# EAGLE design audio_spectrum (EAGLE 6.6.0)
AUTHOR: Joshua Adkins; REV: B; TITLE: AUDIO SPECTRUM MODULE

## Sheet 1 of 2
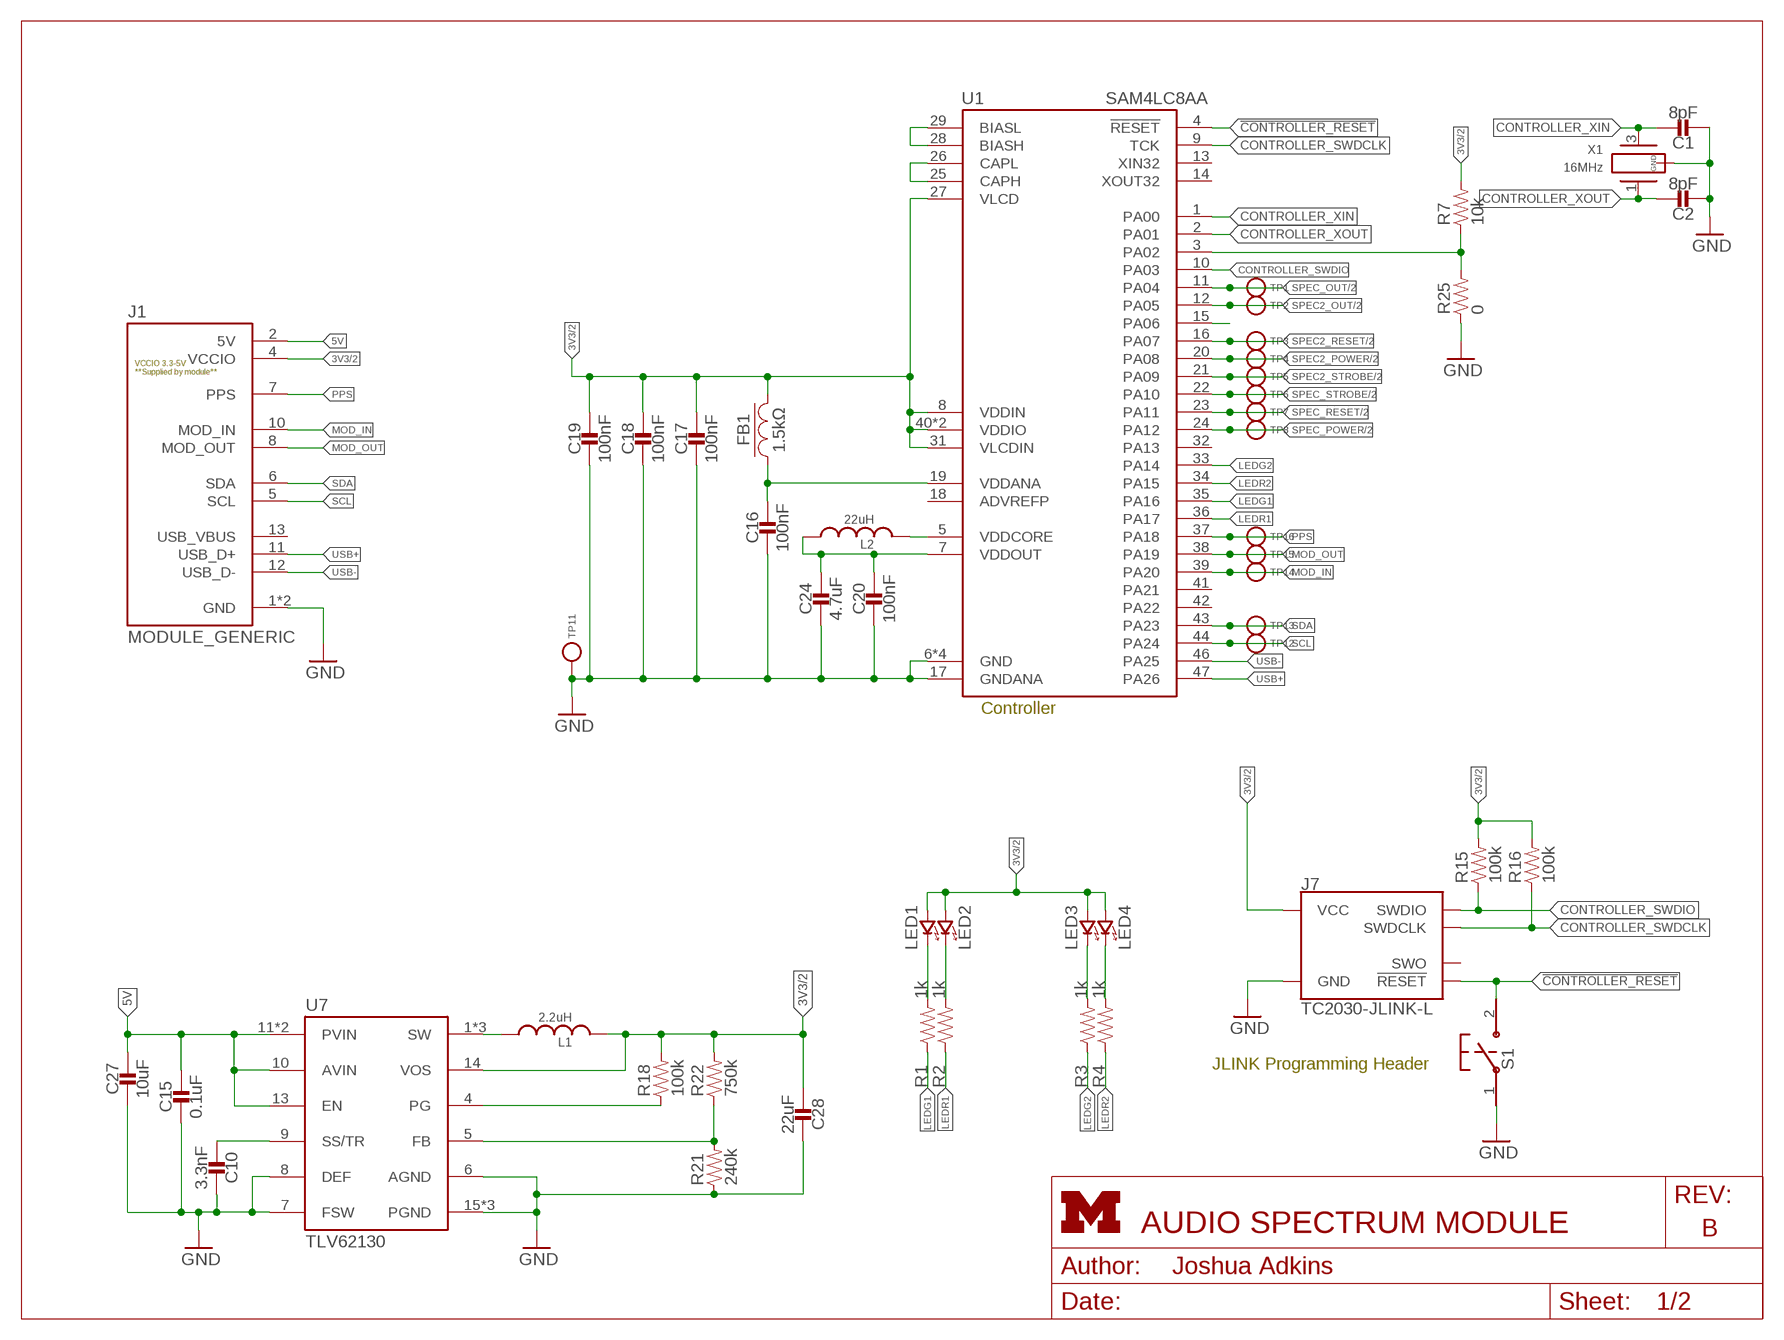
[diagram p0: schematic, sheet 1]
FRAME1 (LETTER_L_UMICH): HEIGHT: 8.5in; WIDTH: 11in

### Parts
C1  8pF  CAPACITOR0603_CAP  [0603_CAP]
C2  8pF  CAPACITOR0603_CAP  [0603_CAP]
C10  3.3nF  CAPACITOR0603_CAP  [0603_CAP]
C15  0.1uF  CAPACITOR0603_CAP  [0603_CAP]
C16  100nF  CAPACITOR0603_CAP  [0603_CAP]
C17  100nF  CAPACITOR0603_CAP  [0603_CAP]
C18  100nF  CAPACITOR0603_CAP  [0603_CAP]
C19  100nF  CAPACITOR0603_CAP  [0603_CAP]
C20  100nF  CAPACITOR0402_CAP  [0402_CAP]
C24  4.7uF  CAPACITOR0402_CAP  [0402_CAP]
C27  10uF  CAPACITOR0603_CAP  [0603_CAP]
C28  22uF  CAPACITOR0603_CAP  [0603_CAP]
FB1  1.5kΩ  FERRITE_BEAD0603  [0603_CAP]
J1  MODULE_GENERIC  [MODULE_GENERIC]
J7  TC2030-JLINK-L  [TC2030-IDC]
L1  2.2uH  INDUCTORIHL  [IHL-1212BZ-11]
L2  22uH  LHQ3NP  [1212]
LED1  LED0603  [LED-0603]
LED2  LED0603  [LED-0603]
LED3  LED0603  [LED-0603]
LED4  LED0603  [LED-0603]
R1  1k  RESISTOR0603_RES  [0603-RES]
R2  1k  RESISTOR0603_RES  [0603-RES]
R3  1k  RESISTOR0603_RES  [0603-RES]
R4  1k  RESISTOR0603_RES  [0603-RES]
R7  10k  RESISTOR0603_RES  [0603-RES]
R15  100k  RESISTOR0603_RES  [0603-RES]
R16  100k  RESISTOR0603_RES  [0603-RES]
R18  100k  RESISTOR0603_RES  [0603-RES]
R21  240k  RESISTOR0603_RES  [0603-RES]
R22  750k  RESISTOR0603_RES  [0603-RES]
R25  0  RESISTOR0603_RES  [0603-RES]
S1  B3U-1000P  [B3U-1000P]
TP1  TEST_POINT_0.040IN  [TESTPOINT_0.040IN]
TP2  TEST_POINT_0.040IN  [TESTPOINT_0.040IN]
TP3  TEST_POINT_0.040IN  [TESTPOINT_0.040IN]
TP4  TEST_POINT_0.040IN  [TESTPOINT_0.040IN]
TP5  TEST_POINT_0.040IN  [TESTPOINT_0.040IN]
TP6  TEST_POINT_0.040IN  [TESTPOINT_0.040IN]
TP7  TEST_POINT_0.040IN  [TESTPOINT_0.040IN]
TP8  TEST_POINT_0.040IN  [TESTPOINT_0.040IN]
TP11  TEST_POINT_0.040IN  [TESTPOINT_0.040IN]
TP12  TEST_POINT_0.040IN  [TESTPOINT_0.040IN]
TP13  TEST_POINT_0.040IN  [TESTPOINT_0.040IN]
TP14  TEST_POINT_0.040IN  [TESTPOINT_0.040IN]
TP15  TEST_POINT_0.040IN  [TESTPOINT_0.040IN]
TP16  TEST_POINT_0.040IN  [TESTPOINT_0.040IN]
U1  SAM4LC8AA  [QFN-48-7MM]
U7  TLV62130  [TQFN-16/3MM]
X1  16MHz  FH1600015  [FHXXX]

### Nets
3V3: C17.1 C18.1 C19.1 C28.2 FB1.2 J1.4(VCCIO) J7.1(VCC) L1.P$2 LED1.A(ANODE) LED2.A(ANODE) LED3.A(ANODE) LED4.A(ANODE) R7.2 R15.2 R16.2 R18.2 R22.2 U1.8(VDDIN) U1.27(VLCD) U1.31(VLCDIN) U1.40(VDDIO) U1.45(VDDIO) U7.14(VOS) ; also sheet 2
3VSWOUT: L1.P$1 U7.1(SW) U7.2(SW) U7.3(SW)
5V: C15.1 C27.1 J1.2(5V) U7.10(AVIN) U7.11(PVIN) U7.12(PVIN) U7.13(EN)
!CONTROLLER_RESET: J7.3(!RESET) S1.2 U1.4(!RESET)
CONTROLLER_BUCK/LDO_N: R7.1 R25.2 U1.3(PA02)
CONTROLLER_SWDCLK: J7.4(SWDCLK) R16.1 U1.9(TCK)
CONTROLLER_SWDIO: J7.2(SWDIO) R15.1 U1.10(PA03)
CONTROLLER_XIN: C1.1 U1.1(PA00) X1.3
CONTROLLER_XOUT: C2.1 U1.2(PA01) X1.1
GND: C1.2 C2.2 C10.1 C15.2 C16.2 C17.2 C18.2 C19.2 C20.2 C24.2 C27.2 C28.1 J1.1(GND) J1.14(GND) J7.5(GND) R21.1 R25.1 S1.1 TP11.TESTPOINT U1.6(GND) U1.17(GNDANA) U1.30(GND) U1.48(GND) U1.THERMAL(GND) U7.6(AGND) U7.7(FSW) U7.8(DEF) U7.15(PGND) U7.16(PGND) U7.GND X1.2(GND) X1.4(GND) ; also sheet 2
LEDG1: R1.1 U1.35(PA16)
LEDG2: R3.1 U1.33(PA14)
LEDR1: R2.1 U1.36(PA17)
LEDR2: R4.1 U1.34(PA15)
MOD_IN: J1.10(MOD_IN) TP14.TESTPOINT U1.39(PA20)
MOD_OUT: J1.8(MOD_OUT) TP15.TESTPOINT U1.38(PA19)
N$21: LED1.C(CATHODE) R1.2
N$23: LED2.C(CATHODE) R2.2
N$25: LED4.C(CATHODE) R4.2
N$31: U1.15(PA06)
N$32: C16.1 FB1.1 U1.19(VDDANA)
N$33: LED3.C(CATHODE) R3.2
N$34: C10.2 U7.9(SS/TR)
N$36: R18.1 U7.4(PG)
N$37: R21.2 R22.1 U7.5(FB)
N$44: C20.1 C24.1 L2.P$1 U1.7(VDDOUT)
N$52: L2.P$2 U1.5(VDDCORE)
N$53: U1.28(BIASH) U1.29(BIASL)
N$54: U1.25(CAPH) U1.26(CAPL)
PPS: J1.7(PPS) TP16.TESTPOINT U1.37(PA18)
SCL: J1.5(SCL) TP12.TESTPOINT U1.44(PA24)
SDA: J1.6(SDA) TP13.TESTPOINT U1.43(PA23)
SPEC2_OUT: TP2.TESTPOINT U1.12(PA05) ; also sheet 2
SPEC2_POWER: TP4.TESTPOINT U1.20(PA08) ; also sheet 2
SPEC2_RESET: TP3.TESTPOINT U1.16(PA07) ; also sheet 2
SPEC2_STROBE: TP5.TESTPOINT U1.21(PA09) ; also sheet 2
SPEC_OUT: TP1.TESTPOINT U1.11(PA04) ; also sheet 2
SPEC_POWER: TP8.TESTPOINT U1.24(PA12) ; also sheet 2
SPEC_RESET: TP7.TESTPOINT U1.23(PA11) ; also sheet 2
SPEC_STROBE: TP6.TESTPOINT U1.22(PA10) ; also sheet 2
USB+: J1.11(USB_D+) U1.47(PA26)
USB-: J1.12(USB_D-) U1.46(PA25)
Unconnected: J1.13(USB_VBUS) J7.6(SWO) U1.13(XIN32) U1.14(XOUT32) U1.18(ADVREFP) U1.32(PA13) U1.41(PA21) U1.42(PA22)

### Notes on the sheet
- Controller
- JLINK Programming Header

## Sheet 2 of 2
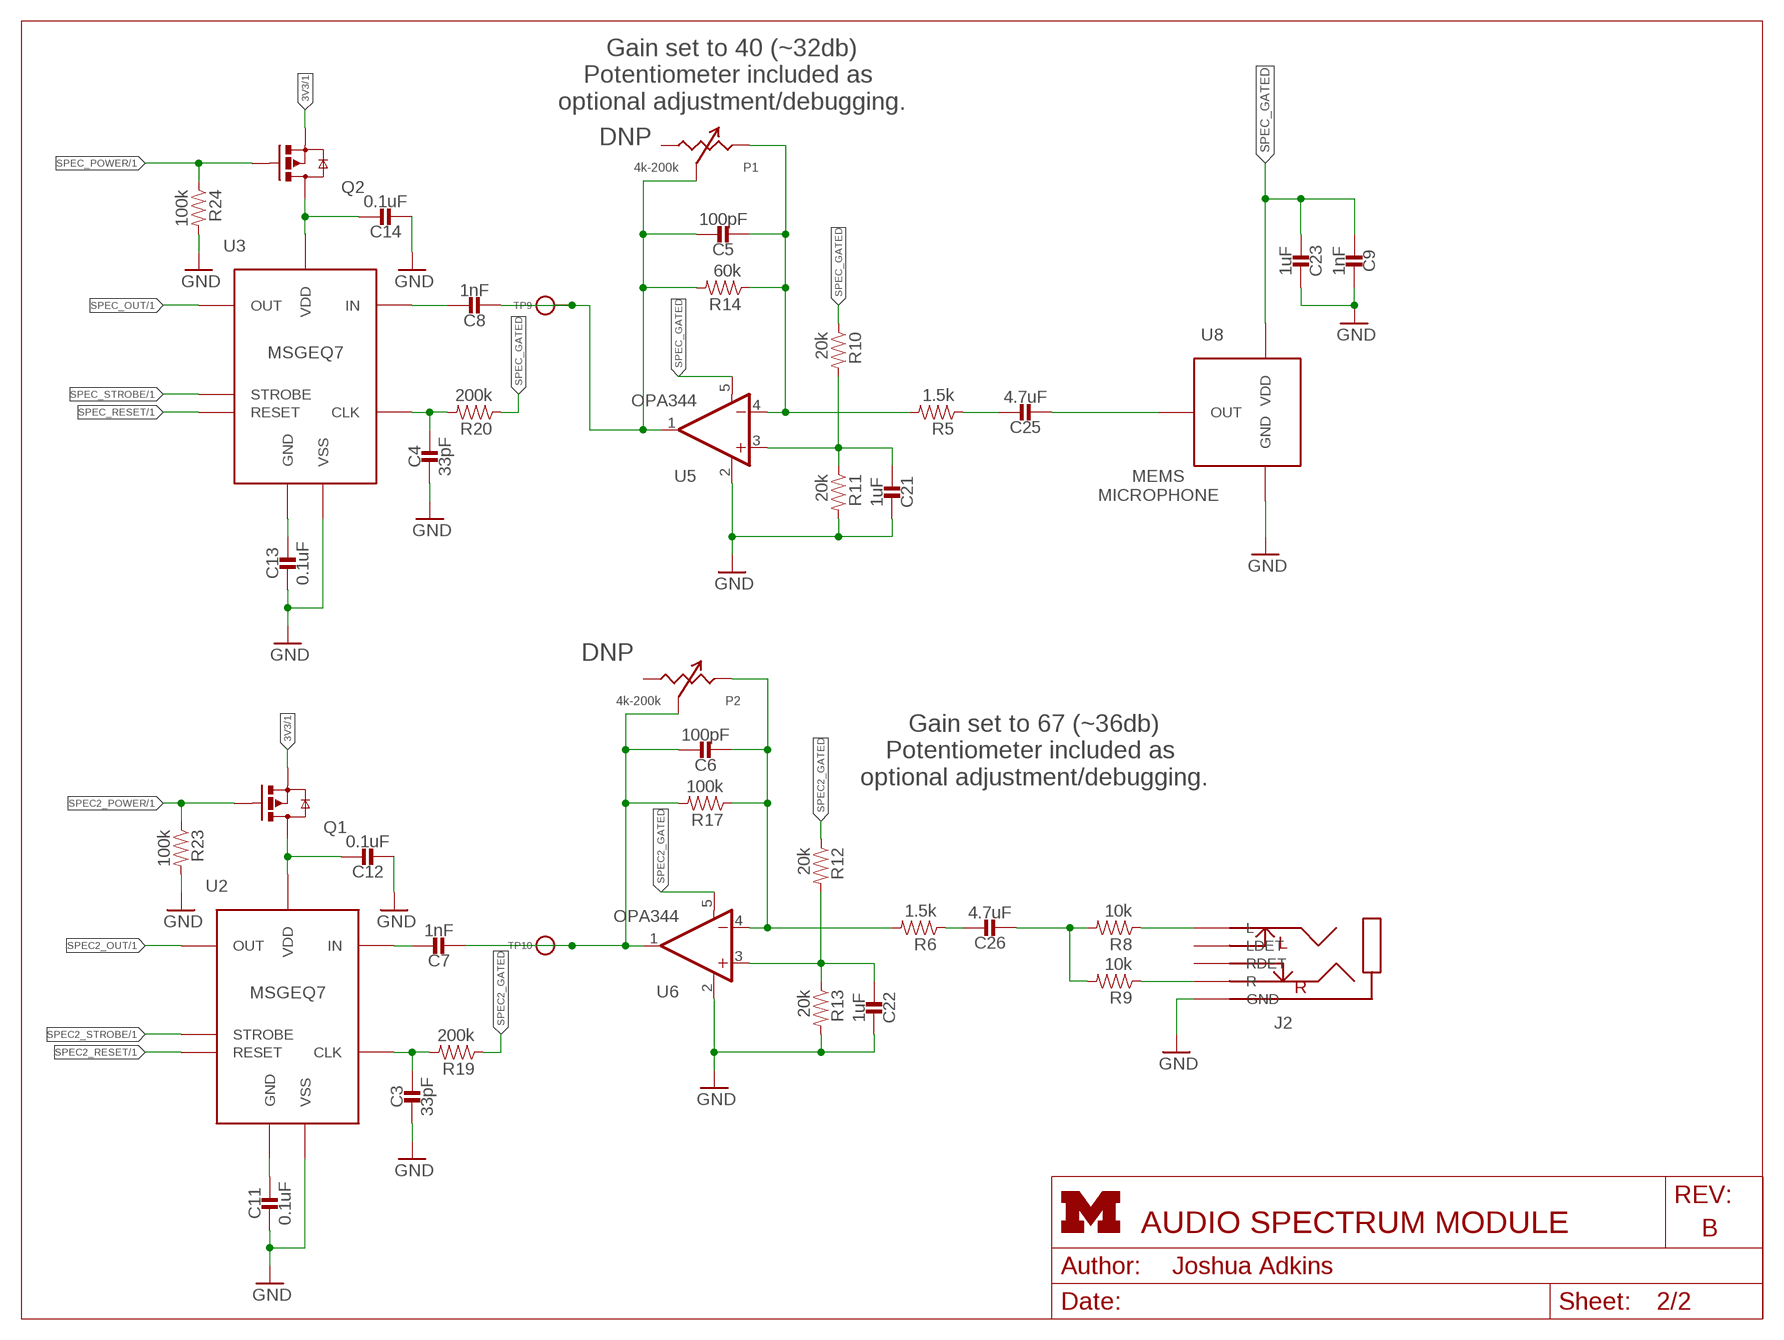
[diagram p1: schematic, sheet 2]
FRAME2 (LETTER_L_UMICH): HEIGHT: 8.5in; WIDTH: 11in

### Parts
C3  33pF  CAPACITOR0603_CAP  [0603_CAP]
C4  33pF  CAPACITOR0603_CAP  [0603_CAP]
C5  100pF  CAPACITOR0603_CAP  [0603_CAP]
C6  100pF  CAPACITOR0603_CAP  [0603_CAP]
C7  1nF  CAPACITOR0603_CAP  [0603_CAP]
C8  1nF  CAPACITOR0603_CAP  [0603_CAP]
C9  1nF  CAPACITOR0603_CAP  [0603_CAP]
C11  0.1uF  CAPACITOR0603_CAP  [0603_CAP]
C12  0.1uF  CAPACITOR0603_CAP  [0603_CAP]
C13  0.1uF  CAPACITOR0603_CAP  [0603_CAP]
C14  0.1uF  CAPACITOR0603_CAP  [0603_CAP]
C21  1uF  CAPACITOR0603_CAP  [0603_CAP]
C22  1uF  CAPACITOR0603_CAP  [0603_CAP]
C23  1uF  CAPACITOR0603_CAP  [0603_CAP]
C25  4.7uF  CAPACITOR0603_CAP  [0603_CAP]
C26  4.7uF  CAPACITOR0603_CAP  [0603_CAP]
J2  AUDIO-JACK-VERTICAL  [AUDIO-JACK-VERTICAL]
P1  4k-200k  POTTC33X  [TC33X-2]
P2  4k-200k  POTTC33X  [TC33X-2]
Q1  NX3008PBK  [SOT23-3]
Q2  NX3008PBK  [SOT23-3]
R5  1.5k  RESISTOR0603_RES  [0603-RES]
R6  1.5k  RESISTOR0603_RES  [0603-RES]
R8  10k  RESISTOR0603_RES  [0603-RES]
R9  10k  RESISTOR0603_RES  [0603-RES]
R10  20k  RESISTOR0603_RES  [0603-RES]
R11  20k  RESISTOR0603_RES  [0603-RES]
R12  20k  RESISTOR0603_RES  [0603-RES]
R13  20k  RESISTOR0603_RES  [0603-RES]
R14  60k  RESISTOR0603_RES  [0603-RES]
R17  100k  RESISTOR0603_RES  [0603-RES]
R19  200k  RESISTOR0603_RES  [0603-RES]
R20  200k  RESISTOR0603_RES  [0603-RES]
R23  100k  RESISTOR0603_RES  [0603-RES]
R24  100k  RESISTOR0603_RES  [0603-RES]
TP9  TEST_POINT_0.040IN  [TESTPOINT_0.040IN]
TP10  TEST_POINT_0.040IN  [TESTPOINT_0.040IN]
U2  MSGEQ7  [DIP-8]
U3  MSGEQ7  [DIP-8]
U5  OPA344  [SOT23-5]
U6  OPA344  [SOT23-5]
U8  MP23AB02B  [MP23AB02B]

### Nets
3V3: Q1.2(S) Q2.2(S) ; also sheet 1
GND: C3.2 C4.2 C9.1 C11.2 C12.2 C13.2 C14.2 C21.1 C22.1 C23.1 J2.5(GND) R11.2 R13.2 R23.2 R24.2 U2.2(VSS) U3.2(VSS) U5.2(V-) U6.2(V-) U8.3(GND) ; also sheet 1
N$1: C11.1 U2.6(GND)
N$2: C3.1 R19.2 U2.8(CLK)
N$3: C7.1 U2.5(IN)
N$4: C6.1 C7.2 P2.3(W) R17.2 TP10.TESTPOINT U6.1(OUT)
N$6: C4.1 R20.2 U3.8(CLK)
N$7: C8.1 U3.5(IN)
N$8: C5.1 C8.2 P1.3(W) R14.2 TP9.TESTPOINT U5.1(OUT)
N$9: C21.2 R10.2 R11.1 U5.3(+IN)
N$10: C26.2 R8.2 R9.2
N$11: C22.2 R12.2 R13.1 U6.3(+IN)
N$12: C5.2 P1.2(CW) R5.2 R14.1 U5.4(-IN)
N$13: C25.1 R5.1
N$14: C6.2 P2.2(CW) R6.2 R17.1 U6.4(-IN)
N$15: C26.1 R6.1
N$16: J2.1(R) R9.1
N$17: J2.4(L) R8.1
N$18: C25.2 U8.1(OUT)
N$19: C13.1 U3.6(GND)
SPEC2_GATED: C12.1 Q1.3(D) R12.1 R19.1 U2.1(VDD) U6.5(V+)
SPEC2_OUT: U2.3(OUT) ; also sheet 1
SPEC2_POWER: Q1.1(G) R23.1 ; also sheet 1
SPEC2_RESET: U2.7(RESET) ; also sheet 1
SPEC2_STROBE: U2.4(STROBE) ; also sheet 1
SPEC_GATED: C9.2 C14.1 C23.2 Q2.3(D) R10.1 R20.1 U3.1(VDD) U5.5(V+) U8.2(VDD)
SPEC_OUT: U3.3(OUT) ; also sheet 1
SPEC_POWER: Q2.1(G) R24.1 ; also sheet 1
SPEC_RESET: U3.7(RESET) ; also sheet 1
SPEC_STROBE: U3.4(STROBE) ; also sheet 1
Unconnected: J2.2(RDET) J2.3(LDET) P1.1(CCW) P2.1(CCW)

### Notes on the sheet
- Gain set to 40 (~32db)
  Potentiometer included as 
  optional adjustment/debugging.
- DNP
- DNP
- Gain set to 67 (~36db)
  Potentiometer included as 
  optional adjustment/debugging.

## Library data of the parts
C1 C2 = passives:CAPACITOR: 0402 Capacitor; DIGIKEY: 490-8230-1-ND
C3-C15 C21-C23 C25-C28 = passives:CAPACITOR: 0402 Capacitor
C16-C20 = passives:CAPACITOR: 0402 Capacitor; DIGIKEY: 490-10777-1-ND
C24 = passives:CAPACITOR: 0402 Capacitor; DIGIKEY: 490-13252-1-ND
FB1 = passives:FERRITE_BEAD; DIGIKEY: 490-5216-1-ND
J1 = signpost:MODULE_GENERIC: Module header and PCB guildes for signposts; DIGIKEY: S9170-ND
J2 = connector:AUDIO-JACK-VERTICAL: A vertical audio jack; MOUSER: 806-STX-3790-5N
J7 = connector:TC2030-JLINK
L1 = passives:INDUCTOR: A very specific inductor; DIGIKEY: 541-1322-1-ND
L2 = signpost:LHQ3NP: LHQ3NP Inductor; DIGIKEY: 490-5350-1-ND
LED1-LED4 = leds:LED: LED
P1 P2 = pots:POT: Potentiometer; DIGIKEY: TC33X-2-204ECT-ND
Q1 Q2 = fets:NX3008PBK: MOSFET - P Channel; DIGIKEY: 568-10499-1-ND; MOUSER: 771-NX3008PBK,215; NEWARK: 74T4665
R1-R4 R7 R25 = passives:RESISTOR: Resistor Basic schematic elements and footprints for 0603, 1206, and PTH resistors.; DIGIKEY: 1276-3431-1-ND
R5 R6 R8-R14 R17-R24 = passives:RESISTOR: Resistor Basic schematic elements and footprints for 0603, 1206, and PTH resistors.
R15 R16 = passives:RESISTOR: Resistor Basic schematic elements and footprints for 0603, 1206, and PTH resistors.; DIGIKEY: 1276-3432-1-ND
S1 = switches:B3U: Switch; DIGIKEY: SW1020CT-ND
TP1-TP16 = headers:TEST_POINT_0.040IN: 0.040in Test Point; DIGIKEY: 5001K-ND
U1 = chips:SAM4LC8AA: Atmel SAM4L microcontroller. ARM Cortex M4 with 512 KB Flash and 64 KB RAM; DIGIKEY: ATSAM4LC8AA-MU-ND
U2 U3 = chips:MSGEQ7: A CMOS spectrum analyzer; DIGIKEY: 1568-1335-ND
U5 U6 = SparkFun-AnalogIC:OPA344: Single gate rail-to-rail output op-amp. Inputs extend 300mV past rails.
U7 = chips:TLV62130: High Efficient 3A switching step-down regulator. 1V-5V out, 4V-17V in.; DIGIKEY: 296-35978-1-ND
U8 = chips:MP23AB02B: A pretty normal mems microphone; DIGIKEY: 497-14947-1-ND
X1 = crystals:FH1600015: Pericom Type FH 16 MHz 2.5 x 2.0 mm; DIGIKEY: FH1600015CT-ND

## Board
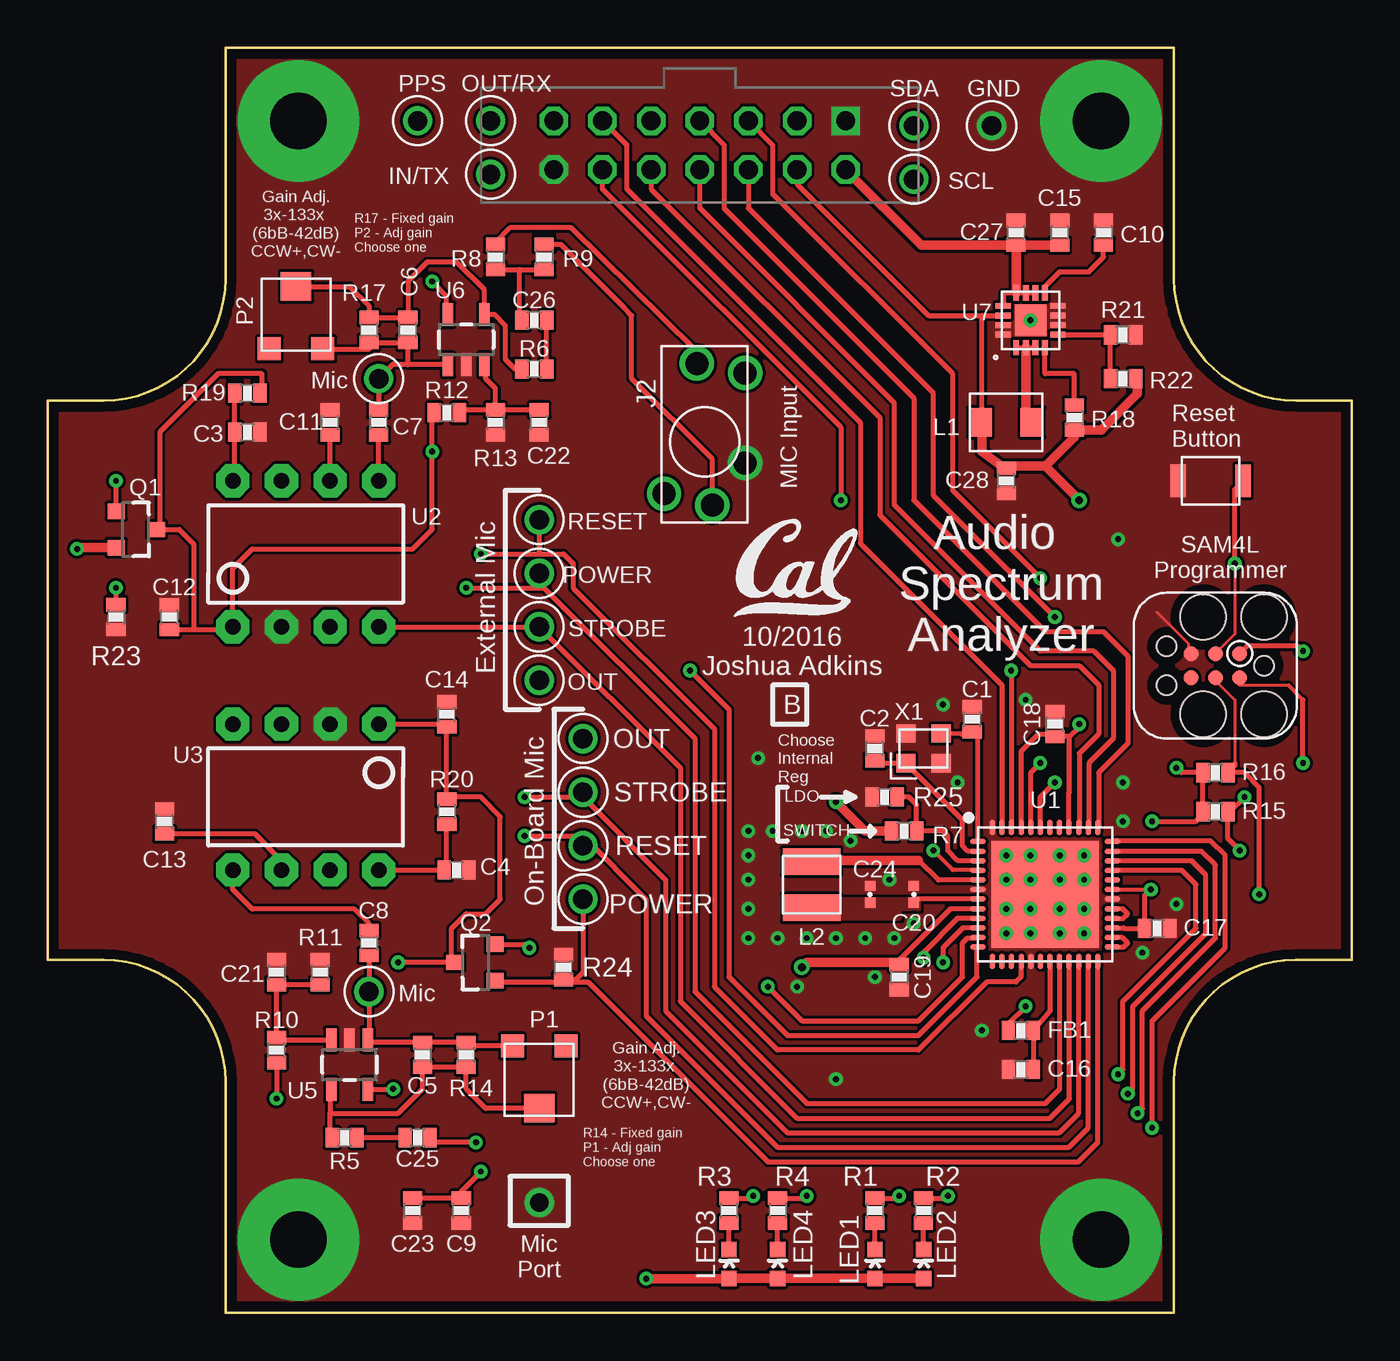
[diagram p2: board, top side]
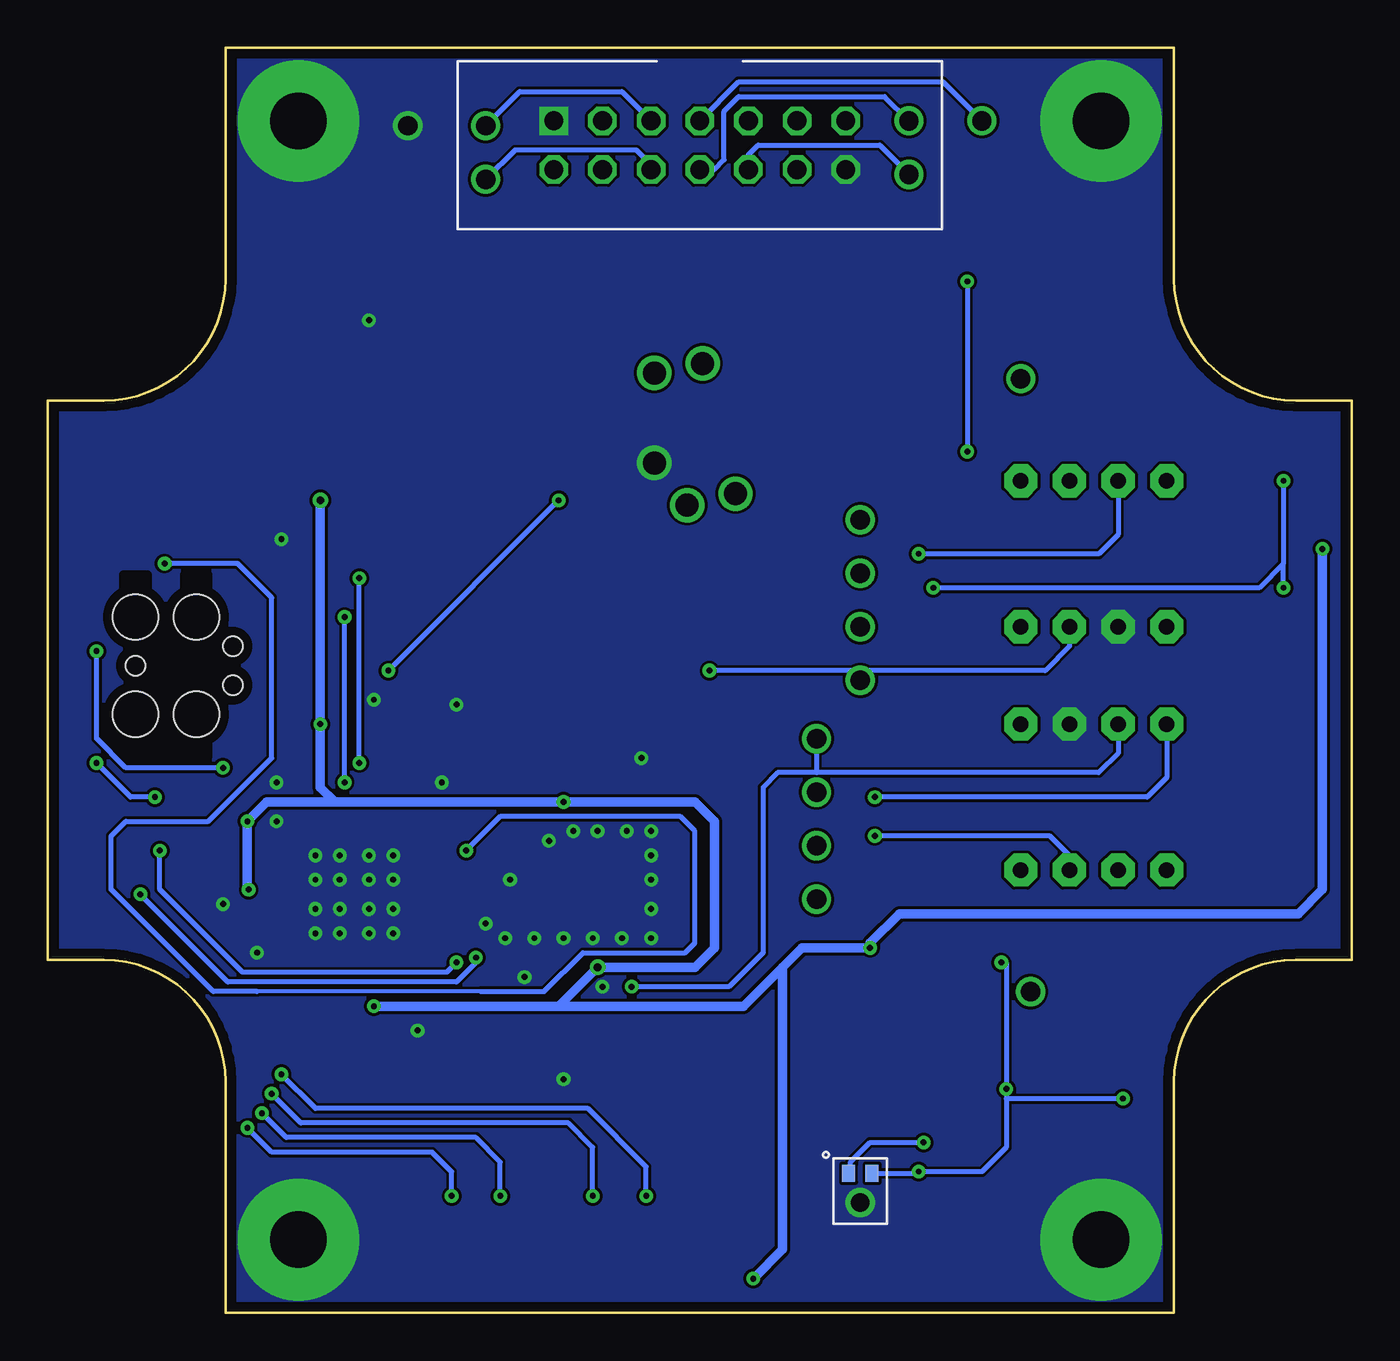
[diagram p3: board, bottom side, seen from below]

Size 68.07 x 66.04 mm. Coordinates in mm from the lower left corner, seen from the top.
Outline: 9.27,66.04 58.8,66.04 58.8,53.98 arc90 65.15,47.62 68.07,47.62 68.07,18.41 65.15,18.41 arc90 58.8,12.07 58.8,0 9.27,0 9.27,12.07 arc90 2.92,18.41 0,18.41 0,47.62 2.92,47.62 arc90 9.27,53.98 9.27,66.04
Copper layers (1*16): Top 0.0178mm / dielectric 59mil / Bottom 0.0178mm
Design rules "quickturn_co_kr_1oz": minimum track width 4mil, minimum drill 0.200659375mm, track to track 4mil, track to pad 4mil, pad to pad 4mil, via to via 4mil, smd to smd 4mil, copper to edge 20mil, drill to drill 16mil, minimum pad ring 8mil, minimum via ring 8mil, stop-mask expansion 3mil, vias tented up to drill 50mil, thermal gap 10mil

### Footprints (pad centres in the part's own frame; a part is rotated, then mirrored left to right if it is on the bottom)
0603_CAP = smd 0.7 x 1: 1 -0.65,0; 2 0.65,0
0402_CAP = smd 0.536 x 0.546: 1 -0.433,0; 2 0.433,0
MODULE_GENERIC = drill 0.991 square: 1 7.62,29.21 | drill 0.991 octagon: 2 7.62,26.67; 3 5.08,29.21; 4 5.08,26.67; 5 2.54,29.21; 6 2.54,26.67; 7 0,29.21; 8 0,26.67; 9 -2.54,29.21; 10 -2.54,26.67; 11 -5.08,29.21; 12 -5.08,26.67; 13 -7.62,29.21; 14 -7.62,26.67
AUDIO-JACK-VERTICAL = drill 1.2: 1 -3.3,-0.4; 2 -2.7,2.12; 3 3.6,-2.12; 4 4.1,0.4; 5 -1.1,-2.12
TC2030-IDC = smd 0.787 x 0.787: 1 -1.27,-0.635; 2 -1.27,0.635; 3 0,-0.635; 4 0,0.635; 5 1.27,-0.635; 6 1.27,0.635 | hole 2.375: -2.54,2.54; 0.635,2.54; 0.635,-2.54; -2.54,-2.54 | hole 1.016: -2.54,0; 2.54,1.016; 2.54,-1.016
IHL-1212BZ-11 = smd 1.2 x 1.5: P$1 -1.35,0; P$2 1.35,0
1212 = smd 1.4 x 3: P$1 -1.2,0; P$2 1.2,0
LED-0603 = smd 0.8 x 0.8: A 0,-0.75; C 0,0.75
TC33X-2 = smd 1.2 x 1.2: 1 -1.4,-2.5; 3 1.4,-2.5 | smd 1.6 x 1.5: 2 0,0.75
SOT23-3 = smd 0.8 x 0.9: 1 -0.95,-1; 2 0.95,-1; 3 0,1.1
0603-RES = smd 0.7 x 1: 1 -0.65,0; 2 0.65,0
B3U-1000P = smd 0.8 x 1.7: 1 -1.7,0; 2 1.7,0
TESTPOINT_0.040IN = drill 1.016: TESTPOINT 0,0
QFN-48-7MM = smd 0.8 x 0.28: 1 -3.5,2.75; 2 -3.5,2.25; 3 -3.5,1.75; 4 -3.5,1.25; 5 -3.5,0.75; 6 -3.5,0.25; 7 -3.5,-0.25; 8 -3.5,-0.75; 9 -3.5,-1.25; 10 -3.5,-1.75; 11 -3.5,-2.25; 12 -3.5,-2.75; 25 3.5,-2.75; 26 3.5,-2.25; 27 3.5,-1.75; 28 3.5,-1.25; 29 3.5,-0.75; 30 3.5,-0.25; 31 3.5,0.25; 32 3.5,0.75; 33 3.5,1.25; 34 3.5,1.75; 35 3.5,2.25; 36 3.5,2.75 | smd 0.28 x 0.8: 13 -2.75,-3.5; 14 -2.25,-3.5; 15 -1.75,-3.5; 16 -1.25,-3.5; 17 -0.75,-3.5; 18 -0.25,-3.5; 19 0.25,-3.5; 20 0.75,-3.5; 21 1.25,-3.5; 22 1.75,-3.5; 23 2.25,-3.5; 24 2.75,-3.5; 37 2.75,3.5; 38 2.25,3.5; 39 1.75,3.5; 40 1.25,3.5; 41 0.75,3.5; 42 0.25,3.5; 43 -0.25,3.5; 44 -0.75,3.5; 45 -1.25,3.5; 46 -1.75,3.5; 47 -2.25,3.5; 48 -2.75,3.5 | smd 5.6 x 5.6: THERMAL 0,0
DIP-8 = drill 0.813 pad 1.727 octagon: 1 -3.81,-3.81; 2 -1.27,-3.81; 3 1.27,-3.81; 4 3.81,-3.81; 5 3.81,3.81; 6 1.27,3.81; 7 -1.27,3.81; 8 -3.81,3.81
SOT23-5 = smd 0.55 x 1.2: 1 -0.95,-1.3; 2 0,-1.3; 3 0.95,-1.3; 4 0.95,1.3; 5 -0.95,1.3
TQFN-16/3MM = smd 0.3 x 0.8: 1 -0.75,-1.43; 2 -0.25,-1.43; 3 0.25,-1.43; 4 0.75,-1.43; 9 0.75,1.43; 10 0.25,1.43; 11 -0.25,1.43; 12 -0.75,1.43 | smd 0.8 x 0.3: 5 1.43,-0.75; 6 1.43,-0.25; 7 1.43,0.25; 8 1.43,0.75; 13 -1.43,0.75; 14 -1.43,0.25; 15 -1.43,-0.25; 16 -1.43,-0.75 | smd 1.63 x 1.63: GND 0,0
MP23AB02B = smd 0.68 x 0.9: 1 -0.61,0.925; 2 0.61,0.925 | drill 0.95 pad 1.55: 3 0,-0.595
FHXXX = smd 1 x 0.95: 1 -0.925,-0.775; 2 0.925,-0.775; 3 0.925,0.775; 4 -0.925,0.775

### Placement (x,y rotation side)
C1  48.26,30.99 90 top
C2  43.18,29.46 90 top
C3  10.41,45.97 0 top
C4  21.34,23.11 0 top
C5  19.56,13.46 270 top
C6  18.8,51.31 90 top
C7  17.27,46.48 90 top
C8  16.76,19.3 270 top
C9  21.59,5.33 90 top
C10  55.12,56.39 270 top
C11  14.73,46.48 90 top
C12  6.35,36.32 90 top
C13  6.1,25.65 90 top
C14  20.83,31.24 90 top
C15  52.83,56.39 90 top
C16  50.8,12.7 180 top
C17  57.91,20.07 0 top
C18  52.58,30.73 90 top
C19  44.45,17.53 270 top
C20  45.21,21.84 90 top
C21  11.94,17.78 270 top
C22  25.65,46.48 90 top
C23  19.05,5.33 90 top
C24  42.93,21.84 90 top
C25  19.3,9.14 0 top
C26  25.4,51.82 180 top
C27  50.55,56.39 90 top
C28  50.04,43.43 90 top
FB1  50.8,14.73 180 top
J1  34.04,33.02 0 top
J2  34.29,45.47 90 top
J7  60.96,33.78 180 top
L1  50.04,46.48 180 top
L2  39.88,22.35 90 top
LED1  43.18,2.54 0 top
LED2  45.72,2.54 0 top
LED3  35.56,2.54 0 top
LED4  38.1,2.54 0 top
P1  25.65,11.43 180 top
P2  12.95,52.83 0 top
Q1  4.57,40.89 270 top
Q2  22.35,18.29 90 top
R1  43.18,5.33 270 top
R2  45.72,5.33 270 top
R3  35.56,5.33 270 top
R4  38.1,5.33 270 top
R5  15.49,9.14 180 top
R6  25.4,49.28 180 top
R7  44.7,25.15 180 top
R8  23.37,55.12 270 top
R9  25.91,55.12 270 top
R10  11.94,13.72 90 top
R11  14.22,17.78 90 top
R12  20.83,46.99 0 top
R13  23.37,46.48 270 top
R14  21.84,13.46 90 top
R15  60.96,26.16 180 top
R16  60.96,28.19 180 top
R17  16.76,51.31 270 top
R18  53.59,46.74 270 top
R19  10.41,48.01 180 top
R20  20.83,26.16 270 top
R21  56.13,51.05 180 top
R22  56.13,48.77 0 top
R23  3.56,36.32 270 top
R24  26.92,18.03 90 top
R25  43.69,26.92 0 top
S1  60.71,43.43 0 top
TP1  27.94,29.97 0 top
TP2  25.65,33.02 0 top
TP3  25.65,41.4 0 top
TP4  25.65,38.61 0 top
TP5  25.65,35.81 0 top
TP6  27.94,27.18 0 top
TP7  27.94,24.38 0 top
TP8  27.94,21.59 0 top
TP9  16.76,16.76 0 top
TP10  17.27,48.77 0 top
TP11  49.28,61.98 0 top
TP12  45.21,61.98 0 top
TP13  45.21,59.18 0 top
TP14  23.11,59.44 0 top
TP15  23.11,62.23 0 top
TP16  19.3,62.23 0 top
U1  52.07,21.84 0 top
U2  13.46,39.62 0 top
U3  13.46,26.92 180 top
U5  15.75,12.95 180 top
U6  21.84,50.8 0 top
U7  51.31,51.82 0 top
U8  25.65,6.35 0 bottom
U$2  [UCB_CAL_200MIL]  35.81,36.32 0 top
X1  45.72,29.46 0 top

### Tracks (layer width: path | path; a pad name or v marks a point on that pad's centre or on a via)
3V3  (via drill 0.3, 0.41)
  Top 0.203: J7.1 62.23,34.54 | U1.31 v57.59,22.09
  Top 0.254: 48.77,52.07 48.77,46.48 L1.P$2 48.69,46.59 | 48.77,52.07 U7.14 | J1.4 39.12,58.93 45.97,52.07 48.77,52.07 | 1.52,39.94 v1.52,39.88 | Q2.2 24.96,19.24 v25.15,19.05 | U1.8 47.11,21.09 44.45,18.43 C19.1 | U1.45 50.82,29.32 51.72,30.23 52.58,30.23 C18.1 53.34,30.08 | U1.40 53.32,27.18 53.34,27.18 53.34,30.08 | 53.34,30.08 53.85,30.59 v53.85,30.73 | 35.55,1.78 LED3.A | U1.27 56.16,20.09 56.19,20.07 C17.1 57.26,21.77 v57.59,22.09 | C28.2 49.9,44.08 49.78,44.2 | v57.66,25.65 59.94,25.65 60.2,25.91 60.2,26.56 R15.2 R16.2 59.18,28.19 v58.93,28.45 | v65.53,34.54 65.28,34.8 62.61,34.8 J7.1 | FB1.2 50.15,15.1 v51.05,16
  Top 0.508: R22.2 56.9,48.77 56.9,47.98 55.01,46.09 R18.2 53.59,45.72 52.07,44.2 | Q1.2 1.52,39.94 | R7.2 42.67,25.15 v41.15,26.67 | 48.77,46.48 48.77,44.96 49.78,44.2 52.07,44.2 | LED2.A LED1.A LED4.A LED3.A | v31.24,1.78 35.55,1.78 | v53.85,42.42 52.07,44.2 | v39.37,18.03 39.62,18.29 44.31,18.29 C19.1
  Bottom 0.254: v58.93,28.45 64.01,28.45 65.53,29.97 v65.53,34.54
  Bottom 0.508: v1.52,39.88 1.52,22.1 2.79,20.83 23.62,20.83 25.15,19.3 v25.15,19.05 28.7,19.05 29.72,18.03 | 53.09,26.67 53.85,27.43 v53.85,30.73 v53.85,42.42 | 29.72,18.03 29.72,3.3 v31.24,1.78 | 53.09,26.67 56.64,26.67 v57.66,25.65 57.66,22.16 v57.59,22.09 | v51.05,16 41.4,16 | 41.4,16 31.75,16 29.72,18.03 | 53.09,26.67 v41.15,26.67 34.29,26.67 33.27,25.65 33.27,19.05 34.29,18.03 v39.37,18.03 41.4,16
3VSWOUT
  Top 0.254: U7.1 U7.2 U7.3
  Top 0.508: L1.P$1 51.06,46.48 U7.2
5V
  Top 0.254: U7.10 U7.11 U7.12 49.88,53.25 U7.13
  Top 0.508: C15.1 C27.1 | C27.1 U7.12 | J1.2 45.61,55.74 C27.1
!CONTROLLER_RESET  (via drill 0.3)
  Top 0.152: v61.98,39.12 61.98,35.43 J7.3
  Top 0.203: U1.4 48.57,23.11 47.24,23.11 v46.23,24.13
  Top 0.254: v61.98,39.12 61.98,43 S1.2
  Bottom 0.203: 45.47,16.76 57.15,16.76
  Bottom 0.254: 57.15,16.76 59.44,16.76 64.77,22.1 64.77,24.89 64.01,25.65 59.69,25.65 56.39,28.96 56.39,37.34 58.17,39.12 v61.98,39.12 | 45.47,16.76 42.16,16.76 40.13,18.8 34.8,18.8 34.29,19.3 34.29,25.15 35.05,25.91 44.45,25.91 v46.23,24.13
CONTROLLER_BUCK/LDO_N
  Top 0.254: U1.3 47.53,23.59 46.99,24.13 46.99,24.89 46.74,25.15 R7.1 45.35,26.53 44.96,26.92 R25.2
CONTROLLER_SWDCLK  (via drill 0.3)
  Top 0.152: 60.96,33.02 61.98,32 61.98,28.7
  Top 0.203: J7.4 60.96,33.02
  Top 0.254: U1.9 47.5,20.59 45.72,18.8 v45.72,18.54 | v63.25,21.84 63.25,27.43 62.48,28.19 R16.1 61.98,28.56 61.98,28.7
  Bottom 0.254: v45.72,18.54 45.72,18.29 46.74,17.27 58.67,17.27 v63.25,21.84
CONTROLLER_SWDIO  (via drill 0.3)
  Top 0.152: J7.2 62.23,32.77 64.77,32.77
  Top 0.203: 64.77,32.77 65.53,32
  Top 0.254: U1.10 47.78,20.09 46.74,19.05 v46.74,18.29 | v62.23,24.13 61.61,24.75 R15.1 61.72,26.16 v62.48,26.92 | v65.53,28.7 65.53,32
  Bottom 0.254: v46.74,18.29 47.24,17.78 57.91,17.78 62.23,22.1 v62.23,24.13 | v62.48,26.92 63.75,26.92 v65.53,28.7
CONTROLLER_XIN
  Top 0.254: X1.3 47.66,30.23 48.15,30.23 C1.1 48.57,30.03 U1.1
CONTROLLER_XOUT
  Top 0.254: C2.1 43.69,28.69 X1.1 47.75,25.73 47.75,24.38 48.04,24.09 U1.2
GND  (via drill 0.3, 2.95 pad 6.35)
  Top 0.152: 59.56,34.42 59.56,34.93 57.91,36.58
  Top 0.254: J7.5 59.56,34.42
  other vias: 51.31,51.82 51.05,32 46.74,31.75 55.88,40.39 50.04,19.81 50.04,23.88 50.04,22.61 50.04,21.08 51.31,19.81 52.83,19.81 54.1,19.81 54.1,21.08 54.1,22.61 54.1,23.88 52.83,23.88 51.31,23.88 51.31,22.61 51.31,21.08 52.83,21.08 52.83,22.61 13.08,62.23 54.99,62.23 54.99,3.81 13.08,3.81 58.93,21.34 47.5,27.69 56.13,25.65 56.13,27.69 57.15,18.8 48.77,14.73 36.58,21.08 36.58,22.61 36.58,23.88 39.12,17.02 36.58,19.56 41.15,19.56 42.67,19.56 44.2,19.56 36.58,25.15 37.85,25.15 39.37,25.15 40.64,25.15 43.18,17.53 45.21,20.32 39.62,19.56 38.1,19.56 41.91,24.64 43.94,22.61 37.08,28.96 41.15,12.19
  pour Bottom (isolate 0.152, rank 2, no thermals): -2.29,74.42 79.25,74.42 79.25,-7.37 -2.29,-7.37
  pour Top (isolate 0.152, rank 2, no thermals): -2.29,74.93 80.26,74.93 80.26,-10.16 -2.29,-10.16
LEDG1  (via drill 0.3)
  Top 0.254: R1.1 44.34,5.98 v44.45,6.1 | v56.9,10.41 57.15,10.67 57.15,15.75 60.96,19.56 60.96,23.37 60.23,24.09 U1.35
  Bottom 0.254: v44.45,6.1 44.45,7.87 45.72,9.14 55.63,9.14 v56.9,10.41
LEDG2  (via drill 0.3)
  Top 0.254: R3.1 36.72,5.98 v36.83,6.1 | v55.88,12.45 56.13,12.7 56.13,16.26 59.94,20.07 59.94,22.35 59.2,23.09 U1.33
  Bottom 0.254: v36.83,6.1 36.83,7.62 39.88,10.67 54.1,10.67 v55.88,12.45
LEDR1  (via drill 0.3)
  Top 0.254: R2.1 46.88,5.98 v46.99,6.1 | v57.66,9.65 57.66,15.24 61.47,19.05 61.47,23.88 60.71,24.64 55.61,24.64 U1.36
  Bottom 0.254: v46.99,6.1 46.99,7.37 48.01,8.38 56.39,8.38 v57.66,9.65
LEDR2  (via drill 0.3)
  Top 0.254: R4.1 39.51,5.98 v39.62,6.1 | v56.39,11.43 56.64,11.68 56.64,16 60.45,19.81 60.45,22.86 59.72,23.59 U1.34
  Bottom 0.254: v39.62,6.1 39.62,8.64 40.89,9.91 54.86,9.91 v56.39,11.43
MOD_IN
  Top 0.254: U1.39 53.85,25.34 53.85,29.21 54.86,30.23 54.86,32.77 53.85,33.78 51.31,33.78 43.43,41.66 43.43,46.74 31.5,58.67 J1.10
  Bottom 0.254: J1.10 31.5,60.45 30.99,60.96 24.64,60.96 TP14.TESTPOINT
MOD_OUT
  Top 0.254: U1.38 54.36,25.34 54.36,28.7 55.63,29.97 55.63,33.53 54.61,34.54 51.82,34.54 44.2,42.16 44.2,47.5 34.04,57.66 J1.8
  Bottom 0.254: J1.8 33.27,59.69 32.77,60.2 32.77,62.74 32,63.5 24.38,63.5 TP15.TESTPOINT
N$1
  Top 0.254: U2.6 C11.1
N$2
  Top 0.254: U2.8 9.76,43.43 C3.1 R19.2
N$3
  Top 0.254: U2.5 C7.1
N$4
  Top 0.254: P2.3 14.86,50.29 16.76,50.29 R17.2 C6.1 18.8,49.53 | U6.1 18.8,49.5 18.8,49.53 | 18.8,49.53 18.03,49.53 TP10.TESTPOINT C7.2
N$6
  Top 0.254: U3.8 C4.1 20.83,23.11 R20.2
N$7
  Top 0.254: C8.1 16.76,20.32 16,21.08 10.67,21.08 9.65,22.1 U3.5
N$8
  Top 0.254: U5.1 16.76,14.25 | C8.2 TP9.TESTPOINT 16.76,14.32 U5.1 | P1.3 22.03,13.93 R14.2 C5.1 16.84,14.11 U5.1
N$9
  Top 0.254: R11.1 C21.2 R10.2 11.94,14.22 14.8,14.22 U5.3
N$10
  Top 0.254: R8.2 24.64,54.47 | 24.64,54.47 R9.2 | C26.2 24.64,51.82 24.64,54.47
N$11
  Top 0.254: C22.2 R13.1 | 22.79,49.28 U6.3 22.86,49.43 22.86,48.77 23.37,48.26 R13.1 | R13.1 21.48,47.13 R12.2
N$12
  Top 0.254: P1.2 22.86,10.67 22.86,10.68 21.84,11.7 R14.1 C5.2 19.56,11.68 18.29,10.41 14.73,10.41 | U5.4 14.73,11.65 14.73,10.41 | R5.2 14.73,9.14 14.73,10.41
N$13
  Top 0.254: R5.1 C25.1
N$14
  Top 0.254: R6.2 24.38,49.28 23.88,49.78 23.88,51.56 23.34,52.1 U6.4 22.79,53.41 21.34,54.86 19.81,54.86 18.8,53.85 C6.2 R17.1 16.76,52.58 15.76,53.58 P2.2
N$15
  Top 0.254: R6.1 C26.1
N$16
  Top 0.254: 26.02,55.88 R9.1 26.78,55.77 30.1,52.45 30.48,52.07 30.48,48.77 34.69,44.56 J2.1
N$17
  Top 0.254: R8.1 23.37,55.88 24.13,56.64 27.32,56.64 33.78,50.29 33.78,49.57 J2.4
N$18  (via drill 0.3)
  Top 0.254: v22.35,8.89 19.95,8.89 C25.2
  Bottom 0.254: U8.1 26.16,7.27 26.16,7.87 25.15,8.89 v22.35,8.89
N$19
  Top 0.254: U3.6 12.19,23.62 10.81,25 C13.1
N$21
  Top 0.254: LED1.C R1.2
N$23
  Top 0.254: LED2.C R2.2
N$25
  Top 0.254: LED4.C R4.2
N$32
  Top 0.254: U1.19 52.32,15.75 FB1.1 C16.1
N$33
  Top 0.254: LED3.C R3.2
N$34
  Top 0.254: U7.9 52.07,53.59 52.83,54.36 54.36,54.36 55.12,55.12 C10.2
N$36
  Top 0.254: R18.1 53.59,49.02 52.06,49.02 U7.4
N$37
  Top 0.254: R22.1 R21.2 55.48,51.07 U7.5
N$44
  Top 0.254: U1.7 45.14,21.59 C20.1
  pour Top (isolate 0.305, no thermals): 38.61,20.57 38.61,21.59 45.47,21.59 45.47,21.08 44.45,21.08 44.45,20.57
N$52
  Top 0.254: L2.P$2 40.06,23.37 40.32,23.62 | U1.5 46.49,22.59 45.47,23.62
  Top 0.508: 45.47,23.62 40.32,23.62
N$53
  Top 0.254: U1.28 55.59,20.57 56.13,20.57 56.39,20.83 56.12,21.09 U1.29
N$54
  Top 0.254: U1.25 56.18,19.09 56.39,19.3 56.1,19.59 U1.26
PPS
  Top 0.254: J1.7 35.31,60.96 35.31,57.66 45.21,47.75 45.21,42.42 52.07,35.56 55.12,35.56 56.39,34.29 56.39,29.72 54.86,28.19 54.86,25.34 U1.37
  Bottom 0.254: J1.7 32,64.26 21.34,64.26 TP16.TESTPOINT
SCL  (via drill 0.3)
  Top 0.254: J1.5 37.85,60.96 37.85,58.42 47.24,49.02 47.24,42.93 v51.82,38.35 | U1.44 51.32,28.19 v51.82,28.7
  Bottom 0.254: v51.82,28.7 v51.82,38.35 | TP12.TESTPOINT 43.43,63.75 38.1,63.75 J1.5
SDA  (via drill 0.3)
  Top 0.254: J1.6 36.58,57.66 46.23,48.01 46.23,42.67 v52.58,36.32 | U1.43 51.82,26.92 v52.58,27.69
  Bottom 0.254: v52.58,27.69 v52.58,36.32 | J1.6 36.58,59.94 37.34,60.71 43.69,60.71 TP13.TESTPOINT
SPEC2_GATED  (via drill 0.3)
  Top 0.254: R19.1 11.18,47.75 11.18,49.02 8.89,49.02 5.84,45.97 5.84,41.06 Q1.3 6.86,40.89 7.62,40.13 7.62,35.67 | U6.5 20.83,52.1 20.83,53.09 v20.07,53.85 | C12.1 7.62,35.67 | 7.62,35.67 9.65,35.67 U2.1 9.65,38.86 10.67,39.88 19.05,39.88 20.07,40.89 v20.07,44.96 20.07,46.88 R12.1
  Bottom 0.254: v20.07,53.85 v20.07,44.96
SPEC2_OUT  (via drill 0.3)
  Top 0.254: v33.53,33.53 35.56,31.5 35.56,17.53 38.61,14.48 45.47,14.48 48.51,17.53 48.51,19.05 U1.12
  Bottom 0.254: U2.3 14.73,34.8 16,33.53 25.65,33.53 | 25.65,33.53 v33.53,33.53 | TP2.TESTPOINT 25.65,33.53
SPEC2_POWER  (via drill 0.3)
  Top 0.254: Q1.1 3.57,43.43 v3.56,43.43 | v21.84,37.85 25.91,37.85 | U1.20 52.83,18.34 52.83,11.68 52.07,10.92 39.62,10.92 33.78,16.76 33.78,29.97 25.91,37.85 | R23.1 v3.56,37.85 | TP4.TESTPOINT 25.65,38.1 25.91,37.85
  Bottom 0.254: v3.56,43.43 3.56,39.12 | 3.56,39.12 4.83,37.85 v21.84,37.85 | v3.56,37.85 3.56,39.12
SPEC2_RESET  (via drill 0.3)
  Top 0.254: v22.61,39.62 25.65,39.62 | 50.8,18.34 U1.16 50.82,17.55 50.55,17.27 49.02,17.27 45.47,13.72 38.1,13.72 34.8,17.02 34.8,30.48 27.43,37.85 27.43,39.12 26.92,39.62 25.65,39.62 | TP3.TESTPOINT 25.65,39.62
  Bottom 0.254: U2.7 12.19,40.64 13.21,39.62 v22.61,39.62
SPEC2_STROBE
  Top 0.254: U2.4 TP5.TESTPOINT 33.02,28.45 33.02,16.26 39.12,10.16 52.32,10.16 53.34,11.18 53.34,18.34 U1.21
SPEC_GATED  (via drill 0.3)
  Top 0.254: v22.61,7.37 21.59,6.35 C9.2 C23.2 | U3.1 20.32,30.73 C14.1 20.83,26.92 | U5.5 18.03,11.65 v18.03,11.68 | R10.1 v11.94,11.18 | v18.29,18.29 Q2.3 21.08,18.29 21.08,20.07 21.84,20.83 22.86,20.83 23.62,21.59 23.62,25.91 22.61,26.92 20.83,26.92 | R20.1 20.83,26.92
  Bottom 0.254: U8.2 22.61,7.27 v22.61,7.37 19.3,7.37 18.03,8.64 18.03,11.18 | 18.03,11.18 v18.03,11.68 18.03,18.29 v18.29,18.29 | v11.94,11.18 18.03,11.18
SPEC_OUT  (via drill 0.3)
  Top 0.254: v37.59,17.02 39.37,15.24 45.47,15.24 47.75,17.53 47.75,19.3 48.01,19.56 48.57,19.56 U1.11
  Bottom 0.254: U3.3 12.19,29.21 13.21,28.19 27.94,28.19 | 27.94,28.19 29.97,28.19 30.73,27.43 30.73,18.8 32.51,17.02 v37.59,17.02 | TP1.TESTPOINT 27.94,28.19
SPEC_POWER
  Top 0.254: Q2.1 23.35,17.27 26.92,17.27 | U1.24 54.82,8.89 53.8,7.87 37.59,7.87 28.19,17.27 26.92,17.27 | 26.92,17.27 R24.1 27.54,17.38 27.94,17.78 TP8.TESTPOINT
SPEC_RESET  (via drill 0.3)
  Top 0.254: v24.89,24.89 27.94,24.89 | U1.23 54.32,9.65 53.3,8.64 38.1,8.64 31.24,15.49 31.24,21.59 27.94,24.89 | TP7.TESTPOINT 27.94,24.89
  Bottom 0.254: U3.7 14.73,23.88 15.75,24.89 v24.89,24.89
SPEC_STROBE  (via drill 0.3)
  Top 0.254: v24.89,26.92 27.94,26.92 | U1.22 53.82,10.41 52.8,9.4 38.61,9.4 32.26,15.75 32.26,22.61 27.94,26.92 | TP6.TESTPOINT 27.94,26.92
  Bottom 0.254: U3.4 9.65,27.94 10.67,26.92 v24.89,26.92
USB+
  Top 0.254: U1.47 49.82,32.77 42.42,40.17 42.42,46.48 30.23,58.67 30.23,60.96 J1.11
USB-  (via drill 0.3)
  Top 0.254: v50.29,33.53 50.32,33.02 U1.46 | v41.4,42.42 41.4,46.23 28.96,58.67 J1.12
  Bottom 0.254: v41.4,42.42 v50.29,33.53

### Text on the board
tPlace: PPS | OUT/RX | SDA | GND | IN/TX | SCL | R17 - Fixed gain / P2 - Adj gain / Choose one | Mic | Reset / Button | RESET | POWER | External Mic | STROBE | Audio / Spectrum / Analyzer | OUT | B | OUT | Choose / Internal / Reg | STROBE | LDO | On-Board Mic | SWITCH | RESET | POWER | Mic | R14 - Fixed gain / P1 - Adj gain / Choose one | Mic / Port
tNames: Gain Adj. / 3x-133x / (6bB-42dB) / CCW+,CW- | MIC Input | SAM4L / Programmer | 10/2016 | Joshua Adkins | Gain Adj. / 3x-133x / (6bB-42dB) / CCW+,CW-